# EAGLE design SWAPv0.1 (EAGLE 9.2.2)
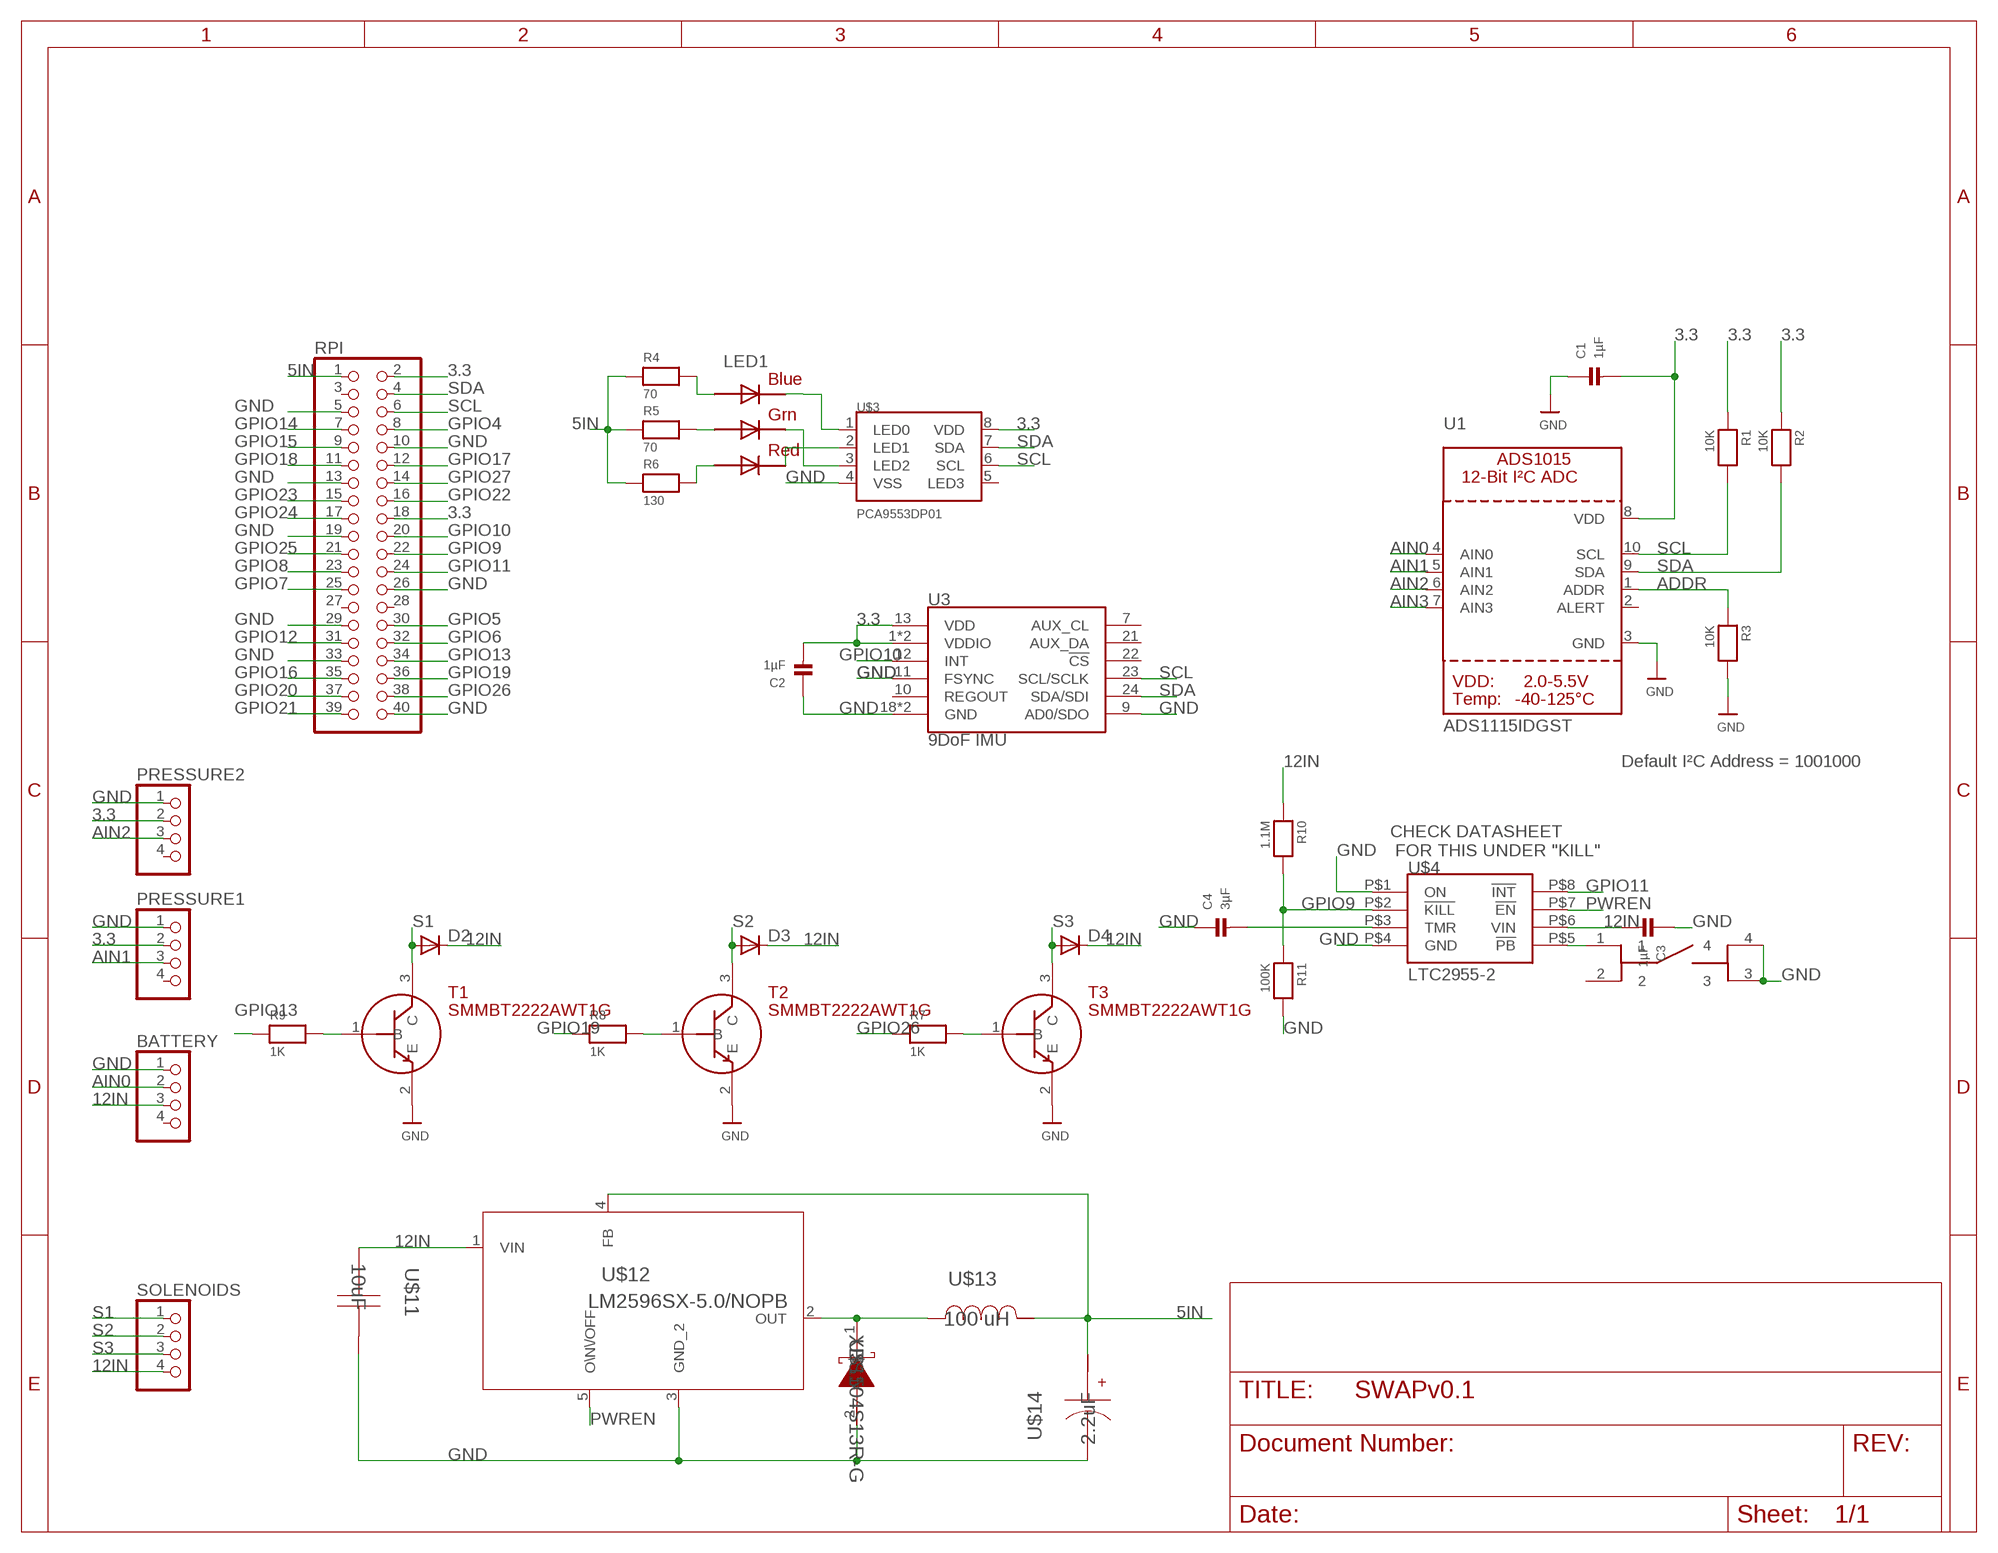
[diagram p0: schematic, sheet 1]

## Parts
BATTERY  JST_4PIN  [JSTPH4]
C1  1µF  CAP_CERAMIC1206  [1206]
C2  1µF  CAP_CERAMIC1206  [1206]
C3  1µF  CAP_CERAMIC1206  [1206]
C4  3µF  CAP_CERAMIC1206  [1206]
D2  DIODE-DO214AA  [DO214AA]
D3  DIODE-DO214AA  [DO214AA]
D4  DIODE-DO214AA  [DO214AA]
LED1  RGBLED5050  [RGBLED5050]
PRESSURE1  JST_4PIN  [JSTPH4]
PRESSURE2  JST_4PIN  [JSTPH4]
R1  10K  RESISTOR2512  [2512]
R2  10K  RESISTOR2512  [2512]
R3  10K  RESISTOR2512  [2512]
R4  70  RESISTOR2512  [2512]
R5  70  RESISTOR2512  [2512]
R6  130  RESISTOR2512  [2512]
R7  1K  RESISTOR2512  [2512]
R8  1K  RESISTOR2512  [2512]
R9  1K  RESISTOR2512  [2512]
R10  1.1M  RESISTOR2512  [2512]
R11  100K  RESISTOR2512  [2512]
RPI  PINHD-2X20  [2X20]
SOLENOIDS  JST_4PIN  [JSTPH4]
T1  SMMBT2222AWT1G  [SOT323]
T2  SMMBT2222AWT1G  [SOT323]
T3  SMMBT2222AWT1G  [SOT323]
U1  ADS1115IDGST  ADC_ADS1015  [MSOP10]
U3  9DoF IMU  MPU-9250  [QFN24-3X3]
U$3  PCA9553DP01  [TSSOP8]
U$4  LTC2955-2  [TSOT23-8]
U$10  B3FS-1015  [B3FS]
U$11  10uF  C2012X5R1V106K085AC  [0805]
U$12  LM2596SX-5.0/NOPB  [TS5B]
U$13  100 uH  MSS1246T-104MLB  [MSS1246T]
U$14  2.2uF  TPSA225K035R1500  [3216-18]
U$15  XBS104S13R-G  [SOD-323]

## Nets
3.3: C1.2 C2.2 PRESSURE1.2 PRESSURE2.2 R1.1 R2.1 RPI.2 RPI.18 U1.8(VDD) U3.1(VDDIO) U3.8(VDDIO) U3.13(VDD) U$3.8(VDD)
5IN: R4.1 R5.1 R6.1 RPI.1 U$12.4(FB) U$13.2 U$14.1(+)
12IN: BATTERY.3 C3.2 D2.C D3.C D4.C R10.1 SOLENOIDS.4 U$4.P$6(VIN) U$11.2 U$12.1(VIN)
ADDR: R3.1 U1.1(ADDR)
AIN0: BATTERY.2 U1.4(AIN0)
AIN1: PRESSURE1.3 U1.5(AIN1)
AIN2: PRESSURE2.3 U1.6(AIN2)
AIN3: U1.7(AIN3)
GND: BATTERY.1 C1.1 C2.1 C3.1 C4.1 PRESSURE1.1 PRESSURE2.1 R3.2 R11.2 RPI.5 RPI.10 RPI.13 RPI.19 RPI.26 RPI.29 RPI.33 RPI.40 T1.2(E) T2.2(E) T3.2(E) U1.3(GND) U3.9(AD0/SDO) U3.11(FSYNC) U3.18(GND) U3.20(GND) U$3.4(VSS) U$4.P$1(ON) U$4.P$4(GND) U$10.3 U$10.4 U$11.1 U$12.3(GND_2) U$14.2(-) U$15.2(A)
GPIO4: RPI.8
GPIO5: RPI.30
GPIO6: RPI.32
GPIO7: RPI.25
GPIO8: RPI.23
GPIO9: R10.2 R11.1 RPI.22 U$4.P$2(!KILL)
GPIO10: RPI.20 U3.12(INT)
GPIO11: RPI.24 U$4.P$8(!INT)
GPIO12: RPI.31
GPIO13: R9.1 RPI.34
GPIO14: RPI.7
GPIO15: RPI.9
GPIO16: RPI.35
GPIO17: RPI.12
GPIO18: RPI.11
GPIO19: R8.1 RPI.36
GPIO20: RPI.37
GPIO21: RPI.39
GPIO22: RPI.16
GPIO23: RPI.15
GPIO24: RPI.17
GPIO25: RPI.21
GPIO26: R7.1 RPI.38
GPIO27: RPI.14
N$2: LED1.4(BLUE_C) U$3.1(LED0)
N$3: LED1.5(RED_C) U$3.2(LED1)
N$4: LED1.3(BLUE_A) R4.2
N$5: LED1.1(GREEN_A) R5.2
N$6: R9.2 T1.1(B)
N$7: LED1.2(RED_A) R6.2
N$8: R8.2 T2.1(B)
N$9: U$4.P$5(!PB) U$10.1
N$10: R7.2 T3.1(B)
N$11: C4.2 U$4.P$3(TMR)
N$12: LED1.6(GREEN_C) U$3.3(LED2)
N$14: U$12.2(OUT) U$13.1 U$15.1(K)
PWREN: U$4.P$7(!EN) U$12.5(O\N\/OFF)
S1: D2.A SOLENOIDS.1 T1.3(C)
S2: D3.A SOLENOIDS.2 T2.3(C)
S3: D4.A SOLENOIDS.3 T3.3(C)
SCL: R1.2 RPI.6 U1.10(SCL) U3.23(SCL/SCLK) U$3.6(SCL)
SDA: R2.2 RPI.4 U1.9(SDA) U3.24(SDA/SDI) U$3.7(SDA)
Unconnected: BATTERY.4 PRESSURE1.4 PRESSURE2.4 RPI.3 RPI.27 RPI.28 U1.2(ALERT) U3.7(AUX_CL) U3.10(REGOUT) U3.21(AUX_DA) U3.22(!CS) U$3.5(LED3) U$10.2

## Notes on the sheet
- Default I²C Address = 1001000
- CHECK DATASHEET
   FOR THIS UNDER "KILL"

## Library data of the parts
BATTERY PRESSURE1 PRESSURE2 SOLENOIDS = microbuilder:JST_4PIN: JST 4-Pin Right-Angle Connector 4UConnector: 17312
C1-C4 = microbuilder:CAP_CERAMIC: Ceramic Capacitors 0402 - 0402 Surface Mount Capacitors 16pF 50V 5% [Digikey: 445-4899-2-ND] 18pF 50V 5% [Digikey: 490-1281-2-ND] 22pF 50V 5% [Digikey: 490-1283-2-ND] 68pF 50V 5% [Digikey: 490-1289-2-ND] 0.1uF 10V 10% [Digikey: 490-1318-2-ND] 1.0uF 6.3V 10% [Digikey: 490-1320-2-ND] 0603 - 0603 Surface Mount Capacitors 16 pF 50V 5% [Digikey: 445-5051-2-ND] 22 pF 50V [Digikey: PCC220ACVTR-ND] 33 pF 50V 5% [Digikey: 490-1415-1-ND] 56pF 50V 5% [Digikey: 490-1421-1-ND] 220pF 50V 5% [Digikey: 445-1285-1-ND] 680 pF 50V 2200 pF 50V 5% C0G [Digikey: 445-1297-1-ND] 5600 pF 100V 5% X7R [Digikey: 478-3711-1-ND] 0.1 µF 25V 10% [Digikey: PCC2277TR-ND] 0.22 µF 16V 10% X7R [Digikey: 445-1318-1-ND] 1.0 µF 25V 10% [Digikey: 445-5146-2-ND] 0603 - RF Specific 3pF 250V +/-0.1pF RF [Digikey: 712-1347-1-ND] 18 pF 250V 5% [Digikey: 478-3505-1-ND or 712-1322-1-ND] 56 pF 250V 5% C0G RF [Digikey: 490-4867-1-ND] 68 pF 250V RF [Digikey: 490-4868-1-ND] 0805 - 0805 Surface Mount Capacitors 220 pF 250V 2% RF Ceramic Capacitor [Digikey: 712-1398-1-ND] 1000 pF 50V 2% NP0 Ceramic Capacitor [Digikey: 478-3760-1-ND] 0.1 µF 25V 10% Ceramic Capacitor [Digikey: PCC1828TR-ND] 1.0 µF 16V 10% Ceramic Capacitor[Digikey: 490-1691-2-ND] 10.0 µF 10V 10% Ceramic Capacitor[Digikey: 709-1228-1-ND] 10.0 uF 16V 10% Ceramic Capacitor [Digikey: 478-5165-2-ND] 47 uF 6.3V 20% Ceramic Capacitor [Digikey: 587-1779-1-ND or 399-5506-1-ND] 1206 - 1206 Surface Mount Capacitors 47uF 10V 20% Ceramic Capacitor [Digikey: 490-5528-1-ND or 399-5508-1-ND or 445-6010-1-ND] 100uF 6.3V -20%, +80% Y5V Ceramic Capacitor (Digikey: 490-4512-1-ND, Mouser: 81-GRM31CF50J107ZE1L)
D2-D4 = diode:DIODE-: DIODE
LED1 = adafruit:RGBLED: For 5050 RGB LEDs, the order of the LEDs may vary from one manufacturer to another!
R1-R11 = microbuilder:RESISTOR: Resistors 0402 - 0402 Surface Mount Package 22 Ohm 1% 1/16W [Digikey: 311-22.0LRTR-ND] 33 Ohm 5% 1/16W 1.0K 5% 1/16W 1.5K 5% 1/16W 2.0K 1% 1/16W 10.0K 1% 1/16W [Digikey: 311-10.0KLRTR-ND] 10.0K 5% 1/16W [Digikey: RMCF0402JT10K0TR-ND] 12.1K 1% 1/16W [Digikey: 311-22.0LRTR-ND] 100.0K 5% 1/16W 0603 - 0603 Surface Mount Package 0 Ohm 1/10 Watt 1% Resistor 15 Ohm 1/10 Watt 1% Resistor 33 Ohm 1/10 Watt 1% Resistor 49.9 Ohm 1/10 Watt 1% Resistor 100 Ohm 1/10 Watt 1% Resistor 150 Ohm 1/10 Watt 1% Resistor 240 Ohm 1/10 Watt 1% Resistor 390 Ohm 1/10 Watt 1% Resistor 560 Ohm 1/10 Watt 1% Resistor 680 Ohm 1/10 Watt 1% Resistor 750 Ohm 1/10 Watt 1% Resistor 1.0K Ohm 1/10 Watt 1% Resistor 1.5K Ohm 1/10 Watt 1% Resistor 2.0K Ohm 1/10 Watt 1% Resistor 2.2K Ohm 1/10 Watt 1% Resistor 3.3K Ohm 1/10 Watt 1% Resistor 4.7K Ohm 1/10 Watt 1% Resistor 10.0K Ohm 1/10 Watt 1% Resistor 12.0K Ohm 1/10 Watt 1% Resistor 12.1K Ohm 1/10 Watt 1% Resistor 20.0K Ohm 1/10 Watt 1% Resistor 33.0K Ohm 1/10 Watt 1% Resistor 100.0K Ohm 1/10 Watt 1% Resistor 0805 - 0805 Surface Mount Package 0 Ohm 1/8 Watt 1% Resistor 33 Ohm 1/8 Watt 1% Resistor 100 Ohm 1/8 Watt 1% Resistor 150 Ohm 1/8 Watt 1% Resistor 200 Ohm 1/8 Watt 1% Resistor 240 Ohm 1/8 Watt 1% Resistor 330 Ohm 1/8 Watt 1% Resistor 390 Ohm 1/8 Watt 1% Resistor 470 Ohm 1/8 Watt 1% Resistor 1.0K Ohm 1/8 Watt 1% Resistor 1.5K Ohm 1/8 Watt 1% Resistor 2.0K Ohm 1/8 Watt 1% Resistor 4.7K Ohm 1/8 Watt 1% Resistor 5.1K Ohm 1/8 Watt 1% Resistor 5.6K Ohm 1/8 Watt 1% Resistor 10.0K Ohm 1/8 Watt 1% Resistor 22.0K Ohm 1/8 Watt 1% Resistor 33.0K Ohm 1/8 Watt 1% Resistor 100K Ohm 1/8 Watt 1% Resistor 1206 - 1206 Surface Mount Package 2012 - 2010 Surface Mount Package 0.11 Ohm 1/2 Watt 1% Resistor - Digikey: RHM.11UCT-ND
RPI = adafruit:PINHD-2X20: PIN HEADER
T1-T3 = SMMBT2222AWT1G:SMMBT2222AWT1G
U1 = microbuilder:ADC_ADS1015: ADS1015 - 12-bit 4-Channel I2C ADC with Internal PGA VDD: 2.0-5.5V Sampling Rate: 3.3ksps Gain Settings: 2/3, 1, 2, 4, 8, 16 I2C Address: ADDR low = 1001000x, ADDR high = 1001001x Internal Comparator The ADS1015 includes an internal comparator that can be set to output a high-level on ALERT when the conversion results exceeeds a pre-defined upper level, and will deassert itself when the level falls below a pre-defined lower threshold level. It can also be set to windowed mode where the ALERT pin will be asserted if the data exceeds the upper threshold or falls below the lower threshold.
U3 = SparkFun-Sensors:MPU-9250: MPU-9250 9 Degree of Freedom IMU System in Package that contains MPU-6500 & AK8963 NC pin 19. 2-6 & 14-17 not internally connected. May be used for PCB trace routing. Datasheet <https://cdn.sparkfun.com/assets/learn_tutorials/5/5/0/MPU9250REV1.0.pdf> SparkFun Products: SparkFun 9DoF Razor IMU M0 <https://www.sparkfun.com/products/14001> SparkFun IMU Breakout - MPU-9250 <https://www.sparkfun.com/products/13762>; PROD_ID: IC-13192
U$3 = jason:PCA9553DP01
U$4 = jason:LTC2955-2; SPICEPREFIX: X
U$10 = jason:B3FS-1015
U$11 = lm2596:C2012X5R1V106K085AC; CAP: 1.0E5; DATASHEETURL: httpsproduct.tdk.comensearchcapacitorceramicmlccinfo?part%5Fno%3DC2012X5R1V106K085AC; ESR: 0.002818; IRMS: 3.88676; MANUFACTURER_NAME: TDK; MANUFACTURER_PART_NUMBER: C2012X5R1V106K085AC; VDC: 35.0; VENDOR: TDK
U$12 = lm2596:LM2596SX-5.0/NOPB; DATASHEETURL: httpwww.ti.comproductlm2596; FREQUENCY: 150000.0; IMAX: 3.0; MANUFACTURER_NAME: Texas Instruments; MANUFACTURER_PART_NUMBER: LM2596SX5.0NOPB; MKTG_PACKAGE: NA; NSID: LM2596TADJNOPB; PACKAGE: NA; VENDOR: Texas Instruments
U$13 = lm2596:MSS1246T-104MLB; DCR: 0.22; IDC: 1.65; L: 1.0E4; MANUFACTURER_NAME: Coilcraft; MANUFACTURER_PART_NUMBER: MSS1246T104MLB; VENDOR: Coilcraft
U$14 = lm2596:TPSA225K035R1500; CAP: 2.2E6; ESR: 1.5; IRMS: 0.201; MANUFACTURER_NAME: AVX; MANUFACTURER_PART_NUMBER: TPSA225K035R1500; VDC: 35.0; VENDOR: AVX
U$15 = lm2596:XBS104S13R-G; DATASHEETURL: httpwww.torexsemi.comproductsschottky%5Fbarrier%5FdiodesdataXBS104S13.pdf; IO: 1.0; MANUFACTURER_NAME: Torex USA Corporation; MANUFACTURER_PART_NUMBER: XBS104S13RG; VENDOR: Torex USA Corporation; VFATIO: 0.54; VRRM: 40.0

## Board
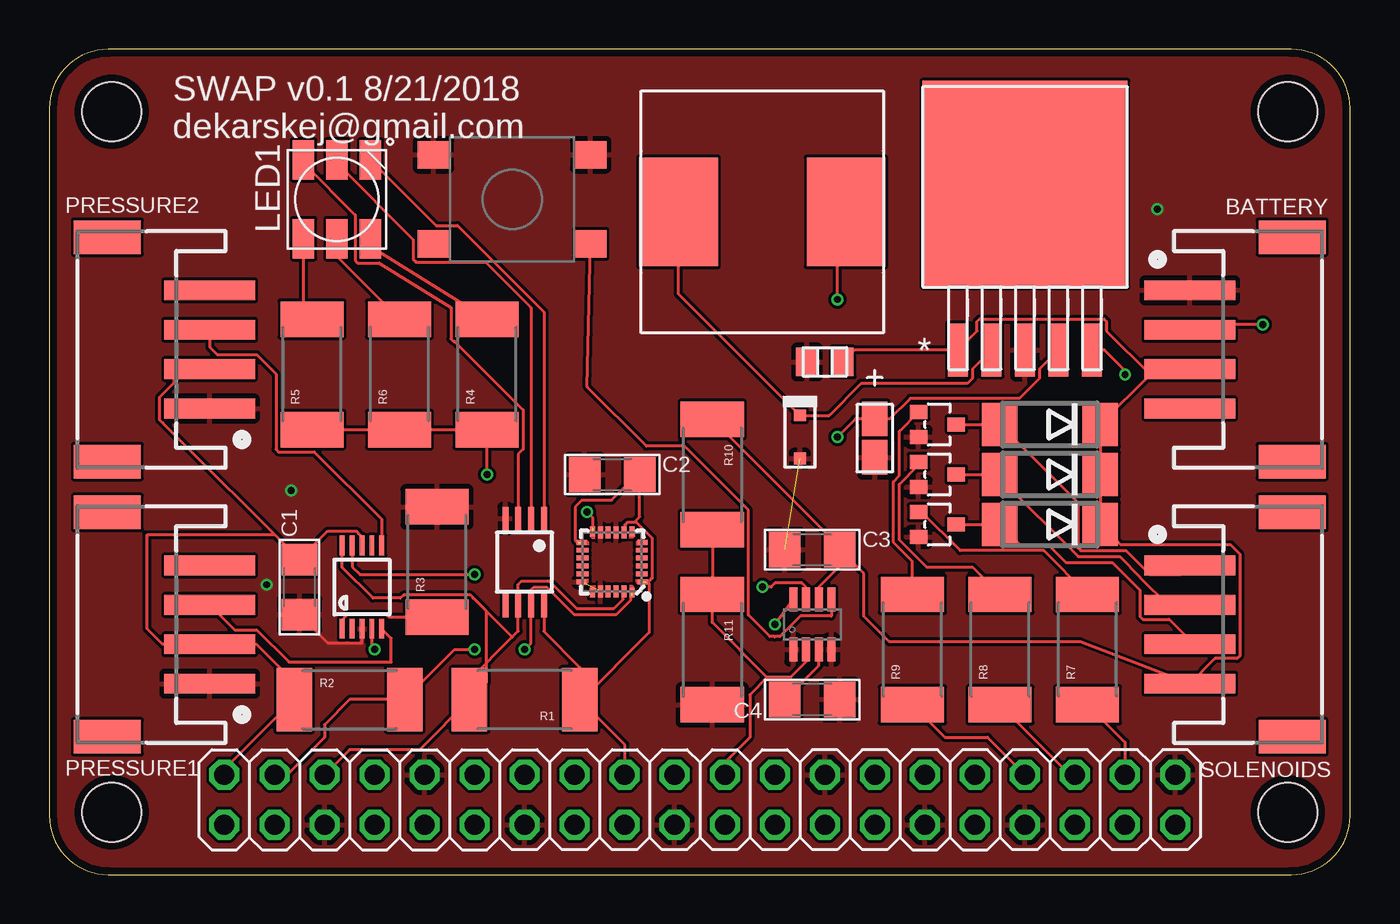
[diagram p1: board, top side]
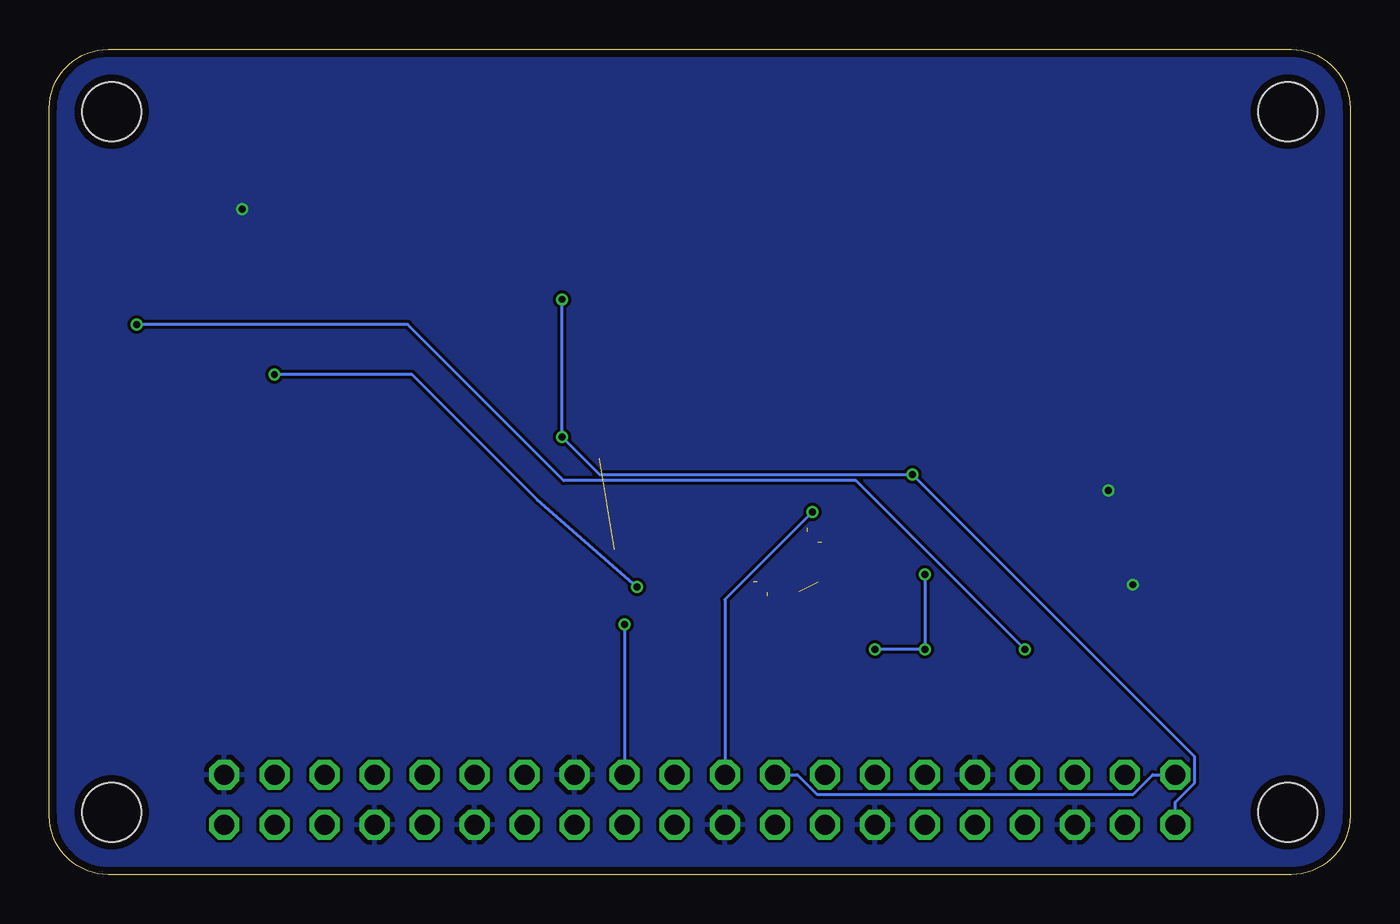
[diagram p2: board, bottom side, seen from below]

Size 66.04 x 41.91 mm. Coordinates in mm from the lower left corner, seen from the top.
Outline: 0,38.91 0,3 arc90 3,0 63.04,0 arc90 66.04,3 66.04,38.91 arc90 63.04,41.91 3,41.91 arc90 0,38.91
Copper layers (1*16): Top 0.035559375mm / dielectric 1.6mm / Bottom 0.035559375mm
Design rules "oshpark-2layer *": minimum track width 6mil, minimum drill 10mil, track to track 6mil, track to pad 6mil, pad to pad 6mil, via to via 6mil, smd to smd 6mil, copper to edge 15mil, drill to drill 6mil, minimum pad ring 5mil, minimum via ring 5mil, stop-mask expansion 2.5mil, vias tented up to drill 25mil, thermal gap 10mil
Holes 3 mm at 3.17,3.17 62.87,3.17 62.87,38.73 3.17,38.73

### Footprints (pad centres in the part's own frame; a part is rotated, then mirrored left to right if it is on the bottom)
JSTPH4 = smd 1 x 4.6: 1 -3,-3.7; 2 -1,-3.7; 3 1,-3.7; 4 3,-3.7 | smd 1.7 x 3.4: NC1 -5.7,1.5; NC2 5.7,1.5
1206 = smd 1.6 x 1.8: 1 -1.4,0; 2 1.4,0
DO214AA = smd 1.8 x 2.2: A 2.55,0; C -2.55,0
RGBLED5050 = smd 2 x 1.1: 1 -2,1.7; 2 -2,0; 3 -2,-1.7; 4 2,-1.7; 5 2,0; 6 2,1.7
2512 = smd 1.8 x 3.2: 1 -2.8,0; 2 2.8,0
2X20 = drill 1.016 octagon: 1 -24.13,-1.27; 2 -24.13,1.27; 3 -21.59,-1.27; 4 -21.59,1.27; 5 -19.05,-1.27; 6 -19.05,1.27; 7 -16.51,-1.27; 8 -16.51,1.27; 9 -13.97,-1.27; 10 -13.97,1.27; 11 -11.43,-1.27; 12 -11.43,1.27; 13 -8.89,-1.27; 14 -8.89,1.27; 15 -6.35,-1.27; 16 -6.35,1.27; 17 -3.81,-1.27; 18 -3.81,1.27; 19 -1.27,-1.27; 20 -1.27,1.27; 21 1.27,-1.27; 22 1.27,1.27; 23 3.81,-1.27; 24 3.81,1.27; 25 6.35,-1.27; 26 6.35,1.27; 27 8.89,-1.27; 28 8.89,1.27; 29 11.43,-1.27; 30 11.43,1.27; 31 13.97,-1.27; 32 13.97,1.27; 33 16.51,-1.27; 34 16.51,1.27; 35 19.05,-1.27; 36 19.05,1.27; 37 21.59,-1.27; 38 21.59,1.27; 39 24.13,-1.27; 40 24.13,1.27
SOT323 = smd 0.711 x 0.889: 1 -0.635,-0.953; 2 0.635,-0.953; 3 0,0.953
MSOP10 = smd 0.25 x 1: 1 -1,-2.113; 2 -0.5,-2.113; 3 0,-2.113; 4 0.5,-2.113; 5 1,-2.113; 6 1,2.113; 7 0.5,2.113; 8 0,2.113; 9 -0.5,2.113; 10 -1,2.113
QFN24-3X3 = smd 0.495 x 0.25: 1 -1.552,1; 6 -1.552,-1; 13 1.552,-1; 18 1.552,1 | smd 0.6 x 0.25: 2 -1.5,0.6; 3 -1.5,0.2; 4 -1.5,-0.2; 5 -1.5,-0.6; 14 1.5,-0.6; 15 1.5,-0.2; 16 1.5,0.2; 17 1.5,0.6 | smd 0.25 x 0.495: 7 -1,-1.552; 12 1,-1.552; 19 1,1.552; 24 -1,1.552 | smd 0.25 x 0.6: 8 -0.6,-1.5; 9 -0.2,-1.5; 10 0.2,-1.5; 11 0.6,-1.5; 20 0.6,1.5; 21 0.2,1.5; 22 -0.2,1.5; 23 -0.6,1.5
TSSOP8 = smd 1.2 x 0.305: 1 -2.2,0.975; 2 -2.2,0.325; 3 -2.2,-0.325; 4 -2.2,-0.975; 5 2.2,-0.975; 6 2.2,-0.325; 7 2.2,0.325; 8 2.2,0.975
TSOT23-8 = smd 0.399 x 1.219: P$1 -0.965,-1.27; P$2 -0.33,-1.27; P$3 0.33,-1.27; P$4 0.965,-1.27; P$5 0.965,1.27; P$6 0.33,1.27; P$7 -0.33,1.27; P$8 -0.965,1.27
B3FS = smd 1.6 x 1.397: 1 3.988,-2.261; 2 -3.988,-2.261; 3 3.988,2.261; 4 -3.988,2.261
0805 = smd 1.118 x 1.448: 1 -0.902,0; 2 0.902,0
TS5B = smd 1.016 x 2.692: 1 -3.404,-8.28; 2 -1.702,-8.28; 3 0,-8.28; 4 1.702,-8.28; 5 3.404,-8.28 | smd 10.414 x 10.465: 6 0,0.152
MSS1246T = smd 3.988 x 5.512: 1 -4.255,0; 2 4.255,0
3216-18 = smd 1.753 x 1.295: 1 -0.978,0; 2 0.978,0
SOD-323 = smd 0.6 x 0.6: 1 -1.1,0; 2 1.1,0

### Placement (x,y rotation side)
BATTERY  61.59,26.67 270 top
C1  12.7,14.61 90 top
C2  28.57,20.32 0 top
C3  38.73,16.51 0 top
C4  38.73,8.89 180 top
D2  50.8,22.86 180 top
D3  50.8,20.32 180 top
D4  50.8,17.78 180 top
LED1  14.61,34.29 90 top
PRESSURE1  4.45,12.7 90 top
PRESSURE2  4.45,26.67 90 top
R1  24.13,8.89 180 top
R2  15.24,8.89 0 top
R3  19.68,15.88 90 top
R4  22.23,25.4 90 top
R5  13.34,25.4 90 top
R6  17.78,25.4 90 top
R7  52.7,11.43 90 top
R8  48.26,11.43 90 top
R9  43.81,11.43 90 top
R10  33.66,20.32 270 top
R11  33.66,11.43 270 top
RPI  33.02,3.81 0 top
SOLENOIDS  61.59,12.7 270 top
T1  45.09,22.86 270 top
T2  45.09,20.32 270 top
T3  45.09,17.78 270 top
U1  15.88,14.61 0 top
U3  28.57,15.88 180 top
U$3  24.13,15.88 270 top
U$4  38.73,12.7 0 top
U$10  23.5,34.29 0 top
U$11  39.37,26.04 0 top
U$12  49.53,34.92 0 top
U$13  36.2,33.66 0 top
U$14  41.91,22.16 270 top
U$15  38.1,22.23 270 top

### Tracks (layer width: path | path; a pad name or v marks a point on that pad's centre or on a via)
3.3  (2 unrouted)
  Top 0.152: 26.99,8.83 R1.1 26.93,9.53 26.93,10.54 25.11,12.36 U$3.8 | 26.99,8.83 29.21,6.61 RPI.18 | RPI.2 8.89,5.34 R2.1 12.44,9.79 10.53,11.7 PRESSURE1.2 5.75,11.7 4.98,12.47 4.98,17.27 11.43,17.27 C1.2 | C1.2 5.76,22.94 5.75,22.94 5.62,23.07 5.62,24.27 6.35,25 6.35,25.4 7.88,25.4 PRESSURE2.2 | C1.2 14.14,17.45 15.6,17.45 15.73,17.31 15.73,17.29 15.88,17.14 U1.8 | U3.8 29.22,17.42 29.22,17.77 29.36,17.9 29.57,17.9 | 29.57,17.9 29.7,17.9 29.98,18.18 C2.2 29.84,20.32 28.55,19.02 27.05,19.02 26.7,18.67 26.7,16.97 26.74,16.93 26.79,16.93 26.84,16.88 | 29.57,17.9 29.8,17.9 30.6,17.09 30.6,15.05 30.47,14.92 30.35,14.92 30.3,14.88 30.36,14.82 30.41,14.82 30.45,14.78 30.45,12.29 26.99,8.83
  Bottom 0.152: RPI.18 28.07,5.08 27.08,4.09 11.02,4.09 10.03,5.08 RPI.2
5IN  (via drill 0.35)
  Top 0.152: R5.1 R6.1 R4.1 v22.23,20.32 | U$12.4 50.27,25.68 50.27,25.2 49.25,24.19 43.7,24.19 42.66,23.14 U$14.1 40.92,23.14 v40.01,22.23 | v40.01,29.21 40.01,33.21 U$13.2
  Bottom 0.152: v40.01,29.21 v40.01,22.23 38.1,20.32 v22.23,20.32 7.9,5.99 7.9,4.67 8.89,3.68 RPI.1
12IN
  Top 0.152: BATTERY.3 56.15,25.67 55.88,25.4 | D3.C D2.C 55.88,25.4 | D3.C D4.C 54.37,16.76 59.96,16.76 60.42,16.3 60.42,11.11 60.29,10.97 59.17,10.97 SOLENOIDS.4 52.34,11.83 42.64,11.83 41.35,13.12 41.35,15.29 C3.2 | U$11.2 40.88,26.64 U$12.1 47.09,27.61 47.09,28.09 47.23,28.22 53.54,28.22 53.67,28.09 53.67,27.61 55.88,25.4 | R10.1 40.13,16.64 C3.2 | C3.2 40.13,15.68 39.06,14.61 U$4.P$6 | D2.C D3.C
ADDR
  Top 0.152: R3.1 17.24,13.07 17.09,13.22 15.15,13.22 14.88,12.94 U1.1
AIN0  (via drill 0.35)
  Top 0.152: U1.4 16.38,11.56 v16.51,11.43 | v61.59,27.94 58.42,27.94 58.15,27.67 BATTERY.2
  Bottom 0.152: v16.51,11.43 25.09,20.02 39.92,20.02 47.85,27.94 v61.59,27.94
AIN1
  Top 0.152: PRESSURE1.3 9.42,12.43 10.54,12.43 12.17,10.79 17.36,10.79 17.36,12 U1.5
AIN2
  Top 0.152: PRESSURE2.3 8.14,26.78 8.53,26.4 10.54,26.4 11.51,25.43 11.51,21.61 11.64,21.47 13.45,21.47 16.88,18.05 U1.6
GND  (via drill 0.35)  (2 unrouted)
  Top 0.152: C1.1 14.14,11.76 15.88,11.76 U1.3
  other vias: 11.04,14.73 12.28,19.52 56.26,33.8
  pour Top (isolate 0): 0,41.91 66.04,41.91 66.04,0 0,0
  pour Bottom (isolate 0): 0,41.91 66.04,41.91 66.04,0 0,0
GPIO9
  Top 0.152: 36.44,10.02 37.63,10.02 38.41,10.79 U$4.P$2 | 36.44,10.02 35.56,9.14 35.56,6.99 34.29,5.71 RPI.22 | 36.44,10.02 33.66,12.8 33.66,13.97 | 33.66,13.97 R11.1 | R10.2 33.66,13.97
GPIO10  (via drill 0.35)  (1 unrouted)
  Top 0.152: v27.3,18.41 27.57,18.14 27.57,17.61
  Bottom 0.152: v27.3,18.41 31.75,13.97 RPI.20
GPIO11  (via drill 0.35)
  Top 0.152: U$4.P$8 v36.83,12.7
  Bottom 0.152: v36.83,12.7 RPI.24
GPIO13
  Top 0.152: R9.1 45.46,6.99 47.62,6.99 RPI.34
GPIO19
  Top 0.152: R8.1 51.81,5.08 RPI.36
GPIO26
  Top 0.152: R7.1 54.61,6.72 RPI.38
N$2
  Top 0.152: LED1.4 19.64,32.96 20.72,32.96 25.11,28.57 U$3.1
N$3
  Top 0.152: U$3.2 24.45,28.79 22.15,31.1 18.61,31.1 18.48,31.24 18.48,32.24 14.61,36.12 LED1.5
N$4
  Top 0.152: R4.2 16.51,31.75 LED1.3
N$5
  Top 0.152: R5.2 12.9,28.63 LED1.1
N$6
  Top 0.152: R9.2 43.81,15.91 42.84,16.88 42.84,19.95 43.16,20.26 43.16,22.52 | 43.16,22.52 43.18,22.54 | 43.18,22.54 T1.1 | 43.16,22.52 43.18,22.54
N$7
  Top 0.152: R6.2 14.61,31.38 LED1.2
N$8
  Top 0.152: R8.2 46.88,15.61 44.55,15.61 43.15,17.01 43.15,19.82 44.13,20.81 T2.1
N$9
  Top 0.152: U$10.1 27.3,24.77 30.32,21.75 32.24,21.75 35.48,18.52 35.48,13.19 36.58,12.09 36.8,12.09 36.83,12.06 36.86,12.09 37.08,12.09 38.12,13.13 39.7,13.13 U$4.P$5
N$10
  Top 0.152: R7.2 50.48,16.45 46.24,16.45 44.28,18.41 T3.1
N$11
  Top 0.152: C4.2 39.06,10.62 U$4.P$3
N$12
  Top 0.152: U$3.3 23.8,21.36 24.05,21.61 24.05,23.59 20.58,27.07 20.53,27.07 20.4,27.2 20.4,28.8 16.75,31.06 15.66,31.06 15.53,31.2 15.53,33.49 12.9,36.12 LED1.6
N$14
  Top 0.152: U$12.2 46.86,25.68 46.86,25.2 46.6,24.95 41.22,24.95 39.59,23.32 U$15.1 31.94,29.48 U$13.1
PWREN  (via drill 0.35)
  Top 0.152: v36.2,14.61 36.64,14.61 36.84,14.81 38.2,14.81 38.41,14.61 U$4.P$7 | U$12.5 53.57,26.64 54.61,25.6 v54.61,25.4
  Bottom 0.152: v54.61,25.4 47.62,25.4 41.27,19.05 v36.2,14.61
S1
  Top 0.152: SOLENOIDS.1 57.44,15.24 55.87,15.24 54.66,16.45 52.35,16.45 52.22,16.59 52.22,18.89 D2.A T1.3
S2
  Top 0.152: T2.3 D3.A 48.25,20.13 52.23,16.15 54.34,16.15 55.37,15.12 55.37,15.11 56.77,13.7 SOLENOIDS.2
S3
  Top 0.152: T3.3 D4.A 49.27,16.76 50.7,16.76 51.61,15.84 53.98,15.84 55.37,14.45 55.37,13.11 55.5,12.97 56.84,12.97 57.9,11.92 SOLENOIDS.3
SCL
  Top 0.152: R1.2 18.79,6.35 15.24,6.35 RPI.6 | R1.2 21.33,9.9 23.5,12.06 | 23.5,12.06 23.8,12.38 U$3.6 23.8,14.74 23.98,14.91 25.38,14.91 26.76,13.53 28.68,13.53 29.13,13.98 29.13,14.33 | 23.5,12.06 21.51,14.05 | 21.51,14.05 21.51,14.07 | 29.13,14.33 U3.23 29.13,14.33 | 21.51,14.05 21.51,14.07 | 21.51,14.07 21.38,14.2 17.99,14.2 17.83,14.05 16.43,14.05 14.88,15.61 U1.10 | R1.2 22.2,9.76 22.2,13.39 21.51,14.07
SDA  (via drill 0.35)  (1 unrouted)
  Top 0.152: RPI.4 12.06,5.08 13.97,6.99 13.97,7.62 15.24,8.89 R2.2 20.58,11.43 v21.59,11.43 | v24.13,11.43 24.45,11.76 U$3.7 24.45,14.46 24.6,14.61 25.25,14.61 26.65,13.21 28.79,13.21 29.53,13.95 29.53,14.1 29.57,14.14 | U1.9 15.38,15.63 15.77,15.24 v21.59,15.24
  Bottom 0.152: v24.13,11.43 v21.59,11.43 v21.59,15.24

### Text on the board
tPlace: SWAP v0.1 8/21/2018 / dekarskej@gmail.com